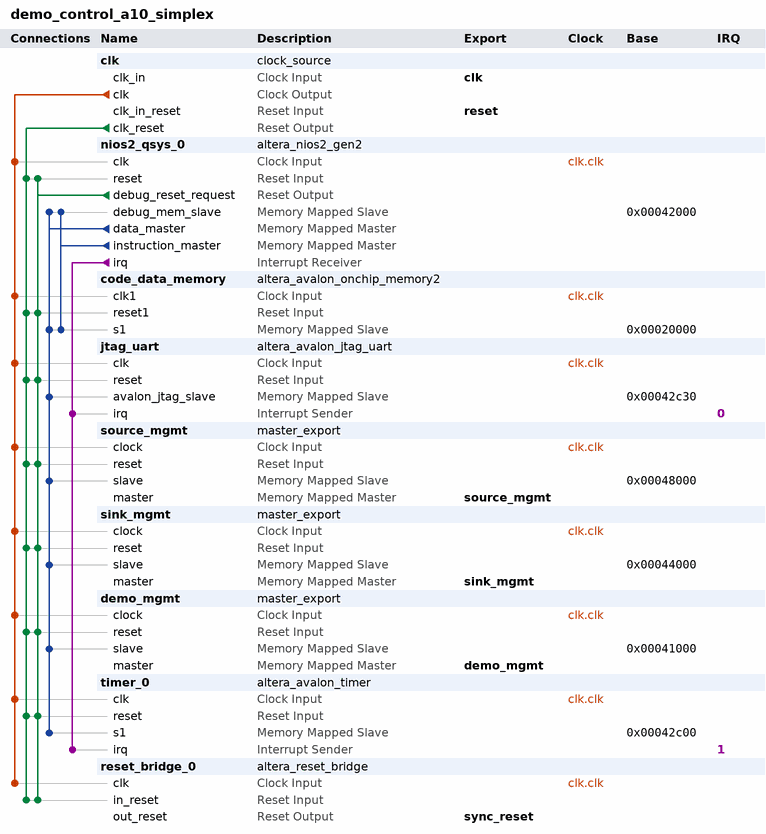
[diagram p0: system contents]
# Platform Designer (Qsys) system demo_control_a10_simplex, Arria 10 10AX115S4F45I3SGES
# Parameters at their usual value, and those the tool derives, are not listed.
package require -exact qsys 16.1
create_system demo_control_a10_simplex
set_project_property DEVICE_FAMILY {Arria 10}
set_project_property DEVICE 10AX115S4F45I3SGES

add_instance clk clock_source 16.1
set_instance_parameter_value clk clockFrequency 100000000

add_instance nios2_qsys_0 altera_nios2_gen2 16.1
set_instance_parameter_value nios2_qsys_0 dcache_size 2048
set_instance_parameter_value nios2_qsys_0 exceptionSlave code_data_memory.s1
set_instance_parameter_value nios2_qsys_0 icache_size 4096
set_instance_parameter_value nios2_qsys_0 impl Tiny
set_instance_parameter_value nios2_qsys_0 resetSlave code_data_memory.s1
set_instance_parameter_value nios2_qsys_0 setting_activateTrace true

add_instance code_data_memory altera_avalon_onchip_memory2 16.1
set_instance_parameter_value code_data_memory dataWidth 32
set_instance_parameter_value code_data_memory dualPort false
set_instance_parameter_value code_data_memory initMemContent true
set_instance_parameter_value code_data_memory initializationFileName code_data_memory
set_instance_parameter_value code_data_memory memorySize 131072

add_instance jtag_uart altera_avalon_jtag_uart 16.1
set_instance_parameter_value jtag_uart simInteractiveOptions INTERACTIVE_INPUT_OUTPUT

add_instance source_mgmt master_export 1.0
set_instance_parameter_value source_mgmt address_width 12
set_instance_parameter_value source_mgmt data_width 32

add_instance sink_mgmt master_export 1.0
set_instance_parameter_value sink_mgmt address_width 12
set_instance_parameter_value sink_mgmt data_width 32

add_instance demo_mgmt master_export 1.0
set_instance_parameter_value demo_mgmt address_width 9
set_instance_parameter_value demo_mgmt data_width 32

add_instance timer_0 altera_avalon_timer 16.1
set_instance_parameter_value timer_0 alwaysRun true
set_instance_parameter_value timer_0 fixedPeriod true
set_instance_parameter_value timer_0 period 1
set_instance_parameter_value timer_0 periodUnits MSEC
set_instance_parameter_value timer_0 snapshot false

add_instance reset_bridge_0 altera_reset_bridge 16.1
set_instance_parameter_value reset_bridge_0 ACTIVE_LOW_RESET 0
set_instance_parameter_value reset_bridge_0 SYNCHRONOUS_EDGES deassert

# connections
add_connection clk.clk code_data_memory.clk1 clock
add_connection clk.clk demo_mgmt.clock clock
add_connection clk.clk jtag_uart.clk clock
add_connection clk.clk nios2_qsys_0.clk clock
add_connection clk.clk reset_bridge_0.clk clock
add_connection clk.clk sink_mgmt.clock clock
add_connection clk.clk source_mgmt.clock clock
add_connection clk.clk timer_0.clk clock
add_connection clk.clk_reset code_data_memory.reset1 reset
add_connection clk.clk_reset demo_mgmt.reset reset
add_connection clk.clk_reset jtag_uart.reset reset
add_connection clk.clk_reset nios2_qsys_0.reset reset
add_connection clk.clk_reset reset_bridge_0.in_reset reset
add_connection clk.clk_reset sink_mgmt.reset reset
add_connection clk.clk_reset source_mgmt.reset reset
add_connection clk.clk_reset timer_0.reset reset
add_connection nios2_qsys_0.debug_reset_request code_data_memory.reset1 reset
add_connection nios2_qsys_0.debug_reset_request demo_mgmt.reset reset
add_connection nios2_qsys_0.debug_reset_request jtag_uart.reset reset
add_connection nios2_qsys_0.debug_reset_request nios2_qsys_0.reset reset
add_connection nios2_qsys_0.debug_reset_request reset_bridge_0.in_reset reset
add_connection nios2_qsys_0.debug_reset_request sink_mgmt.reset reset
add_connection nios2_qsys_0.debug_reset_request source_mgmt.reset reset
add_connection nios2_qsys_0.debug_reset_request timer_0.reset reset
add_connection nios2_qsys_0.data_master code_data_memory.s1 avalon
set_connection_parameter_value nios2_qsys_0.data_master/code_data_memory.s1 baseAddress 0x00020000
add_connection nios2_qsys_0.data_master demo_mgmt.slave avalon
set_connection_parameter_value nios2_qsys_0.data_master/demo_mgmt.slave baseAddress 0x00041000
add_connection nios2_qsys_0.data_master jtag_uart.avalon_jtag_slave avalon
set_connection_parameter_value nios2_qsys_0.data_master/jtag_uart.avalon_jtag_slave baseAddress 0x00042c30
add_connection nios2_qsys_0.data_master nios2_qsys_0.debug_mem_slave avalon
set_connection_parameter_value nios2_qsys_0.data_master/nios2_qsys_0.debug_mem_slave baseAddress 0x00042000
add_connection nios2_qsys_0.data_master sink_mgmt.slave avalon
set_connection_parameter_value nios2_qsys_0.data_master/sink_mgmt.slave baseAddress 0x00044000
add_connection nios2_qsys_0.data_master source_mgmt.slave avalon
set_connection_parameter_value nios2_qsys_0.data_master/source_mgmt.slave baseAddress 0x00048000
add_connection nios2_qsys_0.data_master timer_0.s1 avalon
set_connection_parameter_value nios2_qsys_0.data_master/timer_0.s1 baseAddress 0x00042c00
add_connection nios2_qsys_0.instruction_master code_data_memory.s1 avalon
set_connection_parameter_value nios2_qsys_0.instruction_master/code_data_memory.s1 baseAddress 0x00020000
add_connection nios2_qsys_0.instruction_master nios2_qsys_0.debug_mem_slave avalon
set_connection_parameter_value nios2_qsys_0.instruction_master/nios2_qsys_0.debug_mem_slave baseAddress 0x00042000
add_connection nios2_qsys_0.irq jtag_uart.irq interrupt
set_connection_parameter_value nios2_qsys_0.irq/jtag_uart.irq irqNumber 0
add_connection nios2_qsys_0.irq timer_0.irq interrupt
set_connection_parameter_value nios2_qsys_0.irq/timer_0.irq irqNumber 1

# exported interfaces
add_interface clk clock sink
set_interface_property clk EXPORT_OF clk.clk_in
add_interface demo_mgmt avalon master
set_interface_property demo_mgmt EXPORT_OF demo_mgmt.master
add_interface reset reset sink
set_interface_property reset EXPORT_OF clk.clk_in_reset
add_interface sink_mgmt avalon master
set_interface_property sink_mgmt EXPORT_OF sink_mgmt.master
add_interface source_mgmt avalon master
set_interface_property source_mgmt EXPORT_OF source_mgmt.master
add_interface sync_reset reset source
set_interface_property sync_reset EXPORT_OF reset_bridge_0.out_reset

set_interconnect_requirement {$system} qsys_mm.clockCrossingAdapter HANDSHAKE
set_interconnect_requirement {$system} qsys_mm.maxAdditionalLatency 1

save_system demo_control_a10_simplex.qsys
